# Altium schematic sheet power.SchDoc
size A
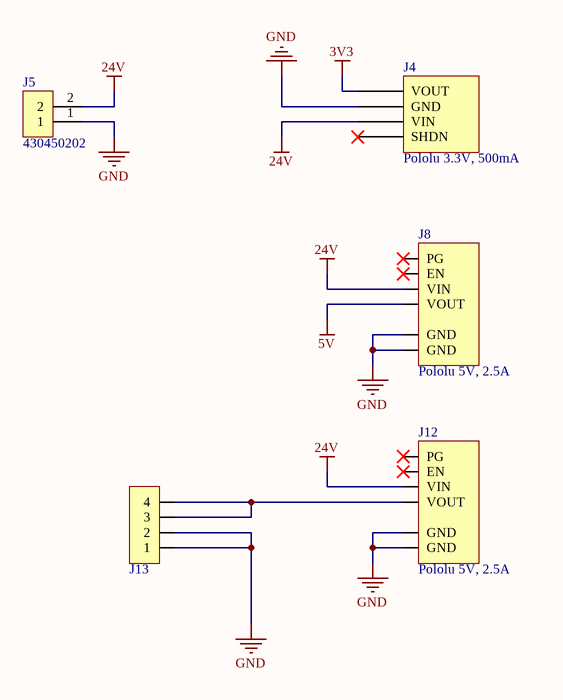
[diagram p0: power.SchDoc]

## Parts
J4  Pololu 3.3V, 500mA  [Pololu 3.3V, 500mA Step-Down Voltage Regulator D24V5F3 - duplicate]
J5  MFG P/N: 430450202  [MOLEX_430450202]  (hidden comment: __Template_Connector_1X2)
J8  Pololu 5V, 2.5A  [Pololu 5V, 2.5A Step-Down Voltage Regulator D24V22F5]
J12  Pololu 5V, 2.5A  [Pololu 5V, 2.5A Step-Down Voltage Regulator D24V22F5]
J13  1x4_PIN  [1x4_PIN]  (value not drawn)

## Nets
3V3: J4.1(VOUT)
5V: J8.5(VOUT)
24V: J4.3(VIN) J5.2 J8.3(VIN) J12.3(VIN)
GND: J4.2(GND) J5.1 J8.4(GND) J8.6(GND) J12.4(GND) J12.6(GND) J13.1 J13.2
NetJ12_5: J12.5(VOUT) J13.3 J13.4

Not connected (* = marked no-connect by the designer): J4 4(SHDN)*; J8 1(PG)* 2(EN)*; J12 1(PG)* 2(EN)*

## Library data of the parts
J4 = Pololu 3.3V, 500mA Step-Down Voltage Regulator D24V5F3
J5 = 958: CONN, HDR, R/A, 2x1, 3MM P, 7.37MM H, GOLD, TH; ID: 958; MFG: Molex, LLC; Connector Type: Header; Pitch: 3.00mm; Number of Positions: 2; Gender: Male; Current Rating: 8A; Voltage, Rated: 600V; Status: Released; RoHS Compliant: Yes; Mounting Type: Through Hole; Orientation: Right Angle; Number of Rows: 1; Features: Board Lock; Supplier 1: Digi-Key; HelpURL: https://www.digikey.in/product-detail/en/molex-llc/0430450202/WM1819-ND/252532; ComponentLink1Description: Datasheet; ComponentLink1URL: https://www.molex.com/pdm_docs/sd/430450202_sd.pdf; Supplier Part Number 1: WM1819-ND
J8 J12 = Pololu 5V, 2.5A Step-Down Voltage Regulator D24V22F5